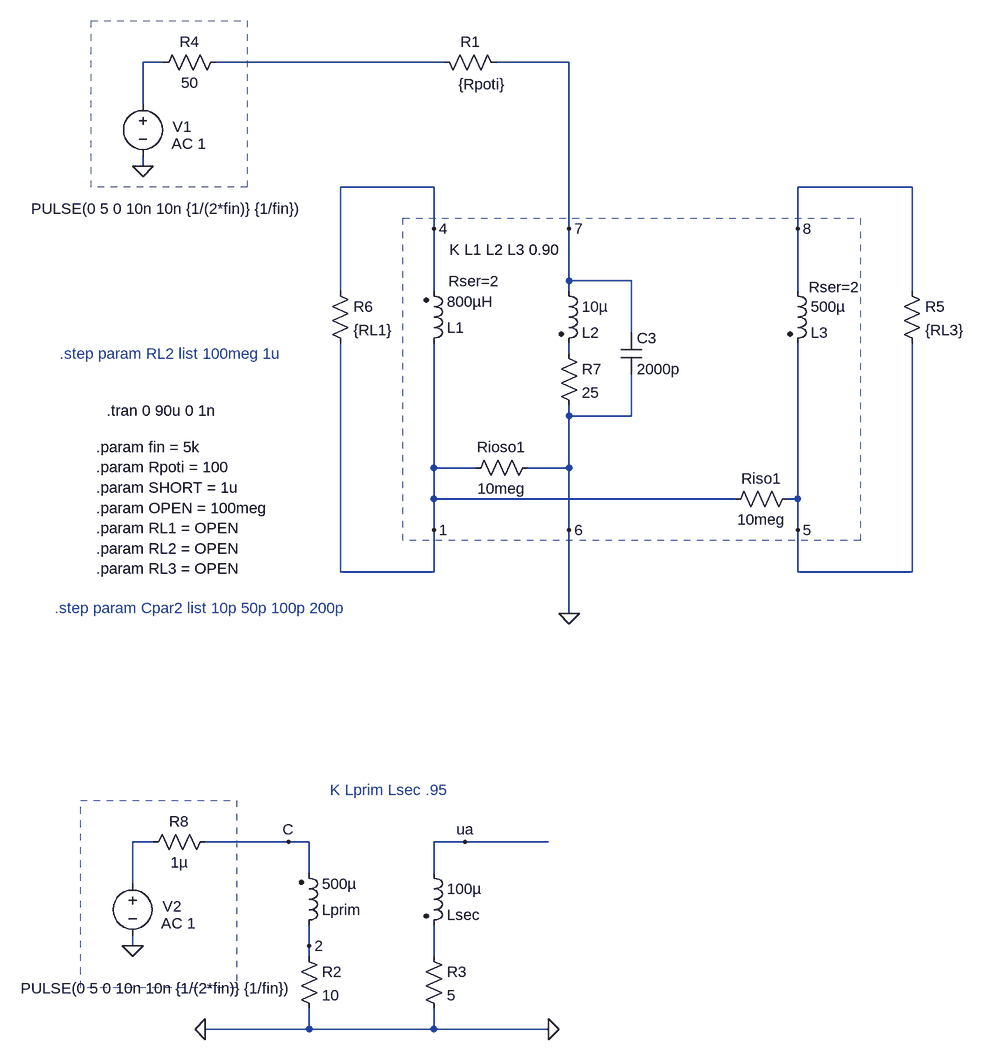
[diagram p0: schematic trafo_mutual.asc]
trafo_mutual.asc, the LTspice schematic file:
Version 4
SHEET 1 2128 3092
WIRE 880 1328 848 1328
WIRE 1312 1328 960 1328
WIRE 1504 1328 1392 1328
WIRE 848 1392 848 1328
WIRE 848 1488 848 1472
WIRE 1296 1520 1152 1520
WIRE 2032 1520 1856 1520
WIRE 1296 1584 1296 1520
WIRE 1504 1584 1504 1328
WIRE 1856 1584 1856 1520
WIRE 1504 1664 1504 1584
WIRE 1600 1664 1504 1664
WIRE 1152 1680 1152 1520
WIRE 1296 1680 1296 1584
WIRE 1504 1680 1504 1664
WIRE 1856 1680 1856 1584
WIRE 2032 1680 2032 1520
WIRE 1600 1744 1600 1664
WIRE 1504 1776 1504 1760
WIRE 1504 1872 1504 1856
WIRE 1600 1872 1600 1808
WIRE 1600 1872 1504 1872
WIRE 1296 1952 1296 1760
WIRE 1360 1952 1296 1952
WIRE 1504 1952 1504 1872
WIRE 1504 1952 1440 1952
WIRE 1296 2000 1296 1952
WIRE 1760 2000 1296 2000
WIRE 1856 2000 1856 1760
WIRE 1856 2000 1840 2000
WIRE 1296 2048 1296 2000
WIRE 1504 2048 1504 1952
WIRE 1856 2048 1856 2000
WIRE 1152 2112 1152 1760
WIRE 1296 2112 1296 2048
WIRE 1296 2112 1152 2112
WIRE 1856 2112 1856 2048
WIRE 2032 2112 2032 1760
WIRE 2032 2112 1856 2112
WIRE 1504 2176 1504 2048
WIRE 864 2528 832 2528
WIRE 1072 2528 944 2528
WIRE 1104 2528 1072 2528
WIRE 1344 2528 1296 2528
WIRE 1472 2528 1344 2528
WIRE 1104 2576 1104 2528
WIRE 1296 2576 1296 2528
WIRE 832 2592 832 2528
WIRE 832 2688 832 2672
WIRE 1104 2688 1104 2656
WIRE 1104 2704 1104 2688
WIRE 1296 2704 1296 2656
WIRE 1104 2816 1104 2784
WIRE 1104 2816 944 2816
WIRE 1296 2816 1296 2784
WIRE 1296 2816 1104 2816
WIRE 1472 2816 1296 2816
FLAG 848 1488 0
FLAG 1296 1584 4
FLAG 1296 2048 1
FLAG 1504 1584 7
FLAG 1856 1584 8
FLAG 1856 2048 5
FLAG 1504 2048 6
FLAG 1504 2176 0
FLAG 832 2688 0
FLAG 944 2816 0
FLAG 1472 2816 0
FLAG 1072 2528 C
FLAG 1344 2528 ua
FLAG 1104 2688 2
SYMBOL ind2 1280 1776 M180
WINDOW 39 38 111 Left 2
SYMATTR SpiceLine Rser=2
SYMATTR InstName L1
SYMATTR Value 800µH
SYMATTR Type ind
SYMBOL ind2 1488 1664 R0
WINDOW 0 36 80 Left 2
WINDOW 3 36 40 Left 2
WINDOW 39 -54 0 Left 2
SYMATTR InstName L2
SYMATTR Value 10µ
SYMATTR Type ind
SYMBOL ind2 1840 1664 R0
WINDOW 0 36 80 Left 2
WINDOW 3 36 40 Left 2
WINDOW 39 33 10 Left 2
SYMATTR InstName L3
SYMATTR Value 500µ
SYMATTR SpiceLine Rser=2
SYMATTR Type ind
SYMBOL res 1856 1984 R90
WINDOW 0 0 56 VBottom 2
WINDOW 3 32 56 VTop 2
SYMATTR InstName Riso1
SYMATTR Value 10meg
SYMBOL res 1456 1936 R90
WINDOW 0 0 56 VBottom 2
WINDOW 3 32 56 VTop 2
SYMATTR InstName Rioso1
SYMATTR Value 10meg
SYMBOL res 1296 1312 M90
WINDOW 0 0 56 VBottom 2
WINDOW 3 34 74 VTop 2
SYMATTR InstName R1
SYMATTR Value {Rpoti}
SYMBOL voltage 848 1376 R0
WINDOW 3 -172 177 Left 2
WINDOW 123 44 77 Left 2
WINDOW 39 0 0 Left 2
WINDOW 0 46 51 Left 2
SYMATTR Value PULSE(0 5 0 10n 10n {1/(2*fin)} {1/fin})
SYMATTR Value2 AC 1
SYMATTR InstName V1
SYMBOL res 976 1312 R90
WINDOW 0 0 56 VBottom 2
WINDOW 3 32 56 VTop 2
SYMATTR InstName R4
SYMATTR Value 50
SYMBOL res 2016 1664 R0
SYMATTR InstName R5
SYMATTR Value {RL3}
SYMBOL res 1136 1664 R0
SYMATTR InstName R6
SYMATTR Value {RL1}
SYMBOL res 1488 1760 R0
SYMATTR InstName R7
SYMATTR Value 25
SYMBOL cap 1584 1744 R0
SYMATTR InstName C3
SYMATTR Value 2000p
SYMBOL ind2 1088 2672 M180
WINDOW 39 38 111 Left 2
SYMATTR InstName Lprim
SYMATTR Value 500µ
SYMATTR Type ind
SYMBOL ind2 1280 2560 R0
WINDOW 0 36 80 Left 2
WINDOW 3 36 40 Left 2
WINDOW 39 -54 0 Left 2
SYMATTR InstName Lsec
SYMATTR Value 100µ
SYMATTR Type ind
SYMBOL res 1088 2688 R0
SYMATTR InstName R2
SYMATTR Value 10
SYMBOL res 1280 2688 R0
SYMATTR InstName R3
SYMATTR Value 5
SYMBOL voltage 832 2576 R0
WINDOW 3 -172 177 Left 2
WINDOW 123 44 77 Left 2
WINDOW 39 0 0 Left 2
WINDOW 0 46 51 Left 2
SYMATTR Value PULSE(0 5 0 10n 10n {1/(2*fin)} {1/fin})
SYMATTR Value2 AC 1
SYMATTR InstName V2
SYMBOL res 960 2512 R90
WINDOW 0 0 56 VBottom 2
WINDOW 3 32 56 VTop 2
SYMATTR InstName R8
SYMATTR Value 1µ
TEXT 1320 1616 Left 2 !K L1 L2 L3 0.90
TEXT 792 1864 Left 2 !.tran 0 90u 0 1n
TEXT 776 1920 Left 2 !.param fin = 5k\n.param Rpoti = 100\n.param SHORT = 1u\n.param OPEN = 100meg\n.param RL1 = OPEN\n.param RL2 = OPEN\n.param RL3 = OPEN
TEXT 720 1776 Left 2 ;.step param RL2 list 100meg 1u
TEXT 712 2168 Left 2 ;.step param Cpar2 list 10p 50p 100p 200p
TEXT 1136 2448 Left 2 ;K Lprim Lsec .95
RECTANGLE Normal 1952 2064 1248 1568 2
RECTANGLE Normal 1008 1520 768 1264 2
RECTANGLE Normal 992 2752 752 2464 2

The netlist it stands for:
* trafo_mutual.asc
L1 1 4 800µH Rser=2
L2 7 N003 10µ
L3 8 5 500µ Rser=2
Riso1 5 1 10meg
Rioso1 0 1 10meg
R1 N002 7 {Rpoti}
V1 N001 0 PULSE(0 5 0 10n 10n {1/(2*fin)} {1/fin}) AC 1
R4 N002 N001 50
R5 8 5 {RL3}
R6 4 1 {RL1}
R7 N003 0 25
C3 7 0 2000p
Lprim 2 C 500µ
Lsec ua N005 100µ
R2 2 0 10
R3 N005 0 5
V2 N004 0 PULSE(0 5 0 10n 10n {1/(2*fin)} {1/fin}) AC 1
R8 C N004 1µ
K L1 L2 L3 0.90
.tran 0 90u 0 1n
.param fin = 5k
.param Rpoti = 100
.param SHORT = 1u
.param OPEN = 100meg
.param RL1 = OPEN
.param RL2 = OPEN
.param RL3 = OPEN
* .step param RL2 list 100meg 1u
* .step param Cpar2 list 10p 50p 100p 200p
* K Lprim Lsec .95
.backanno
.end